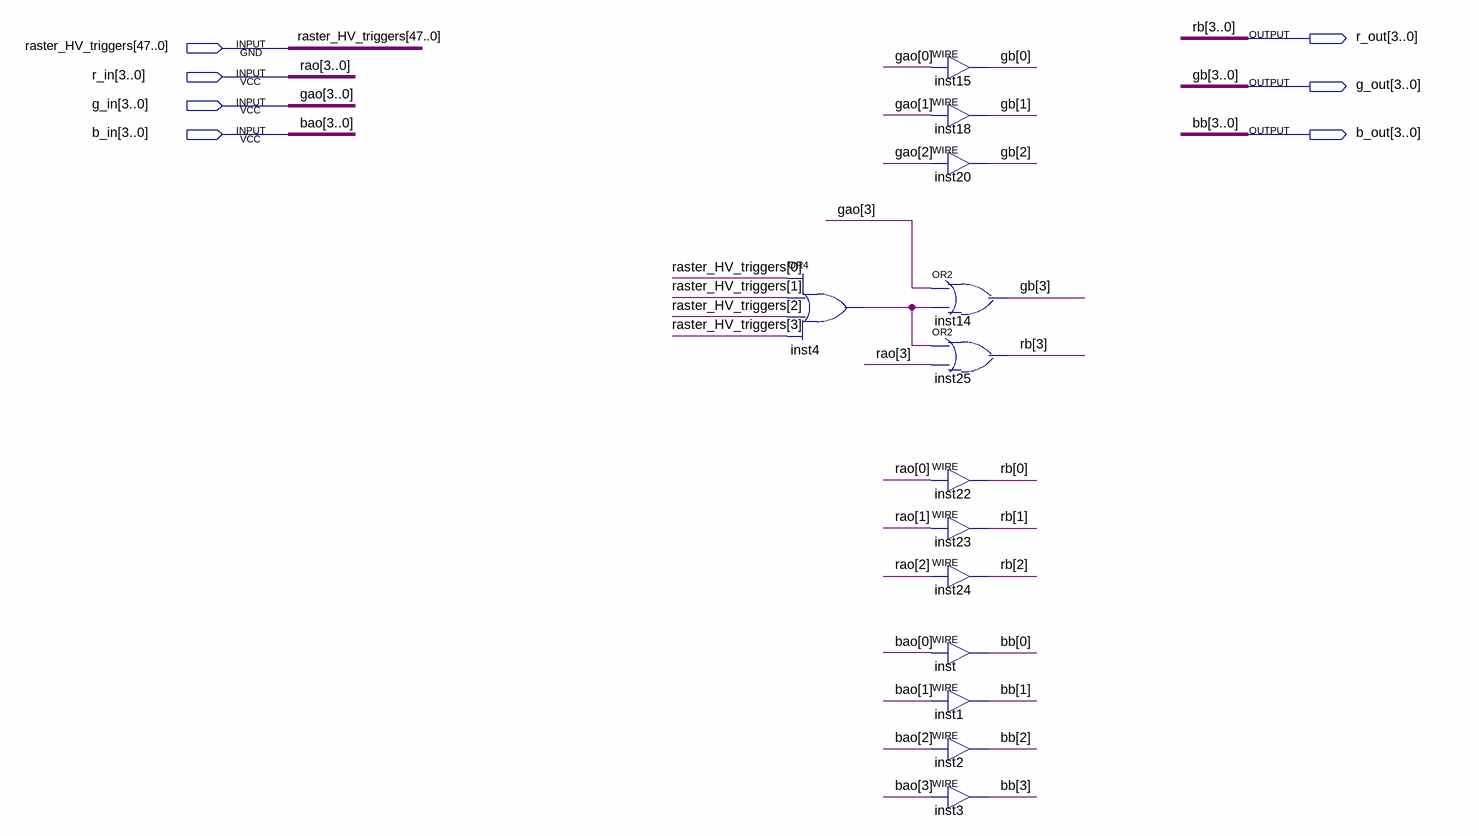
[diagram p0: schematic sheet]
// Quartus schematic raster_trigger_mux.bdf as structural Verilog: 13 symbols, 7 pins
module raster_trigger_mux (
  input  [47:0] raster_HV_triggers,
  input  [3:0] r_in,
  input  [3:0] g_in,
  input  [3:0] b_in,
  output [3:0] r_out,
  output [3:0] g_out,
  output [3:0] b_out
);

  wire inst4_out;

  or inst4 (inst4_out, raster_HV_triggers[0], raster_HV_triggers[1], raster_HV_triggers[2], raster_HV_triggers[3]);
  assign g_out[0] = g_in[0];  // WIRE inst15
  assign g_out[1] = g_in[1];  // WIRE inst18
  assign g_out[2] = g_in[2];  // WIRE inst20
  or inst14 (g_out[3], g_in[3], inst4_out);
  or inst25 (r_out[3], inst4_out, r_in[3]);
  assign r_out[0] = r_in[0];  // WIRE inst22
  assign r_out[1] = r_in[1];  // WIRE inst23
  assign r_out[2] = r_in[2];  // WIRE inst24
  assign b_out[0] = b_in[0];  // WIRE inst
  assign b_out[1] = b_in[1];  // WIRE inst1
  assign b_out[2] = b_in[2];  // WIRE inst2
  assign b_out[3] = b_in[3];  // WIRE inst3

  // Other names for the same wires on the sheet: bao[3:0] = b_in; bb[3:0] = b_out; gao[3:0] = g_in; gb[3:0] = g_out;
  //   rao[3:0] = r_in; rb[3:0] = r_out
endmodule
